# Altium schematic sheet Power.SchDoc
size A; SheetNumber: 3; SheetTotal: 3
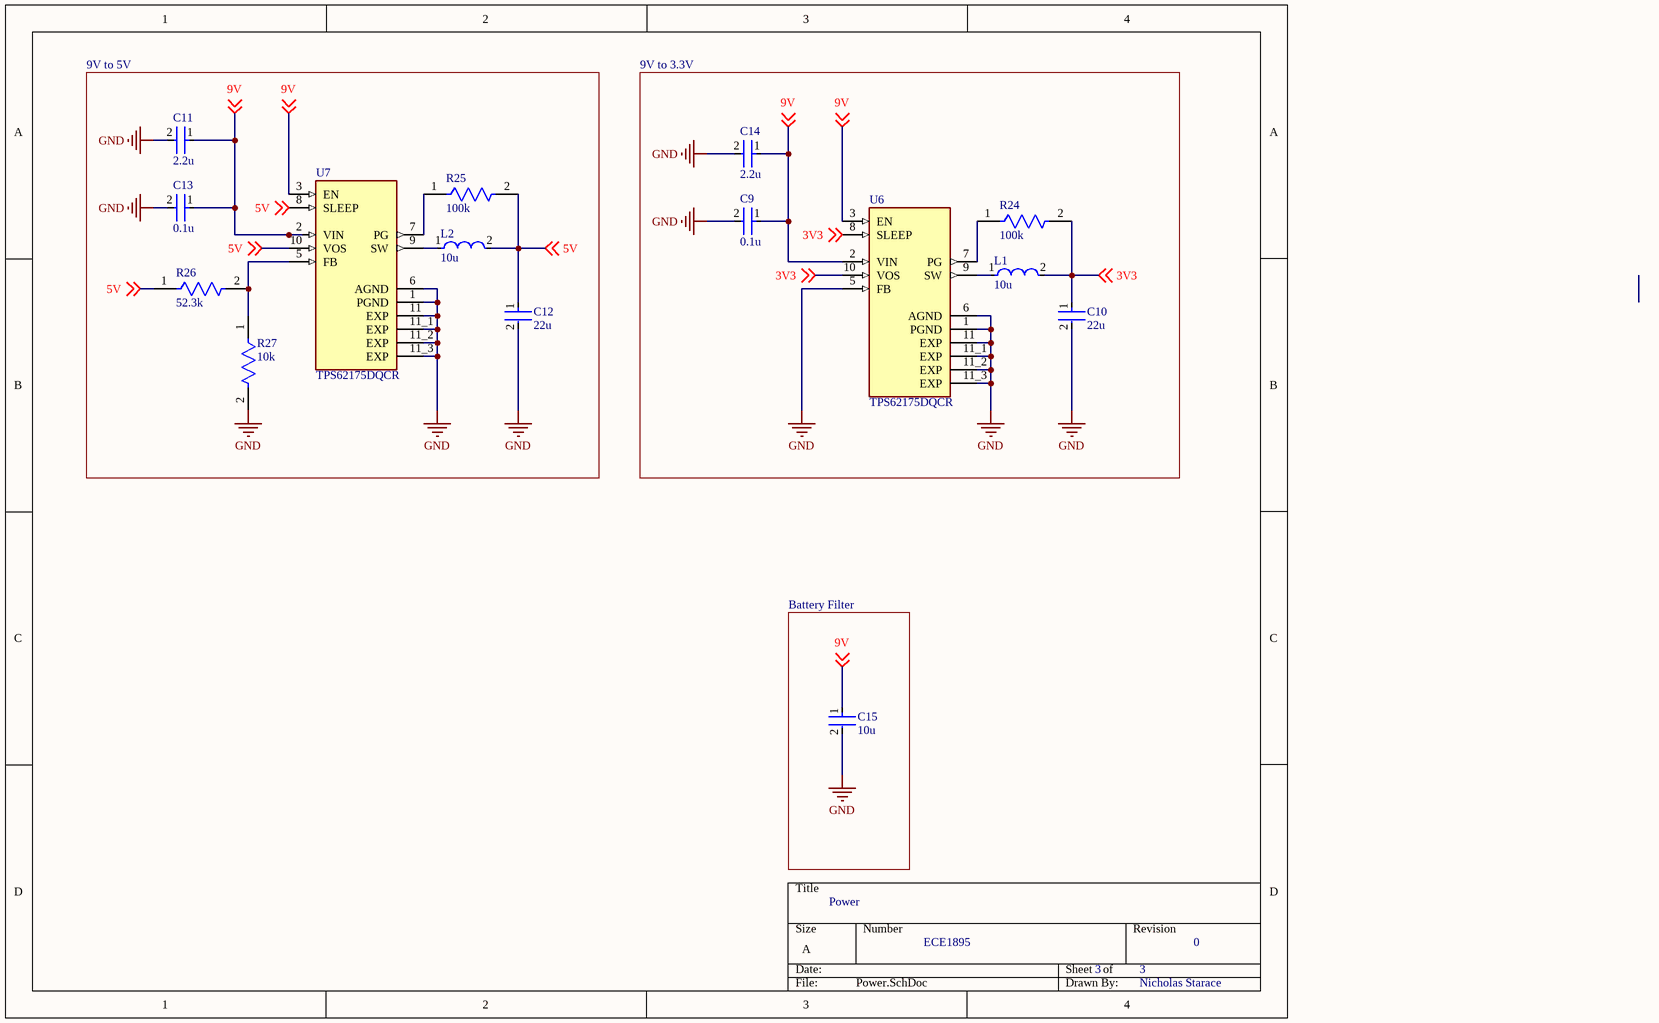
[diagram p0: Power.SchDoc]

## Parts
C9  0.1u  [FP-GRM21B-0_2-e0_2_0_7-IPC_B]
C10  22u  [FP-GRM21B-0_2-e0_2_0_7-IPC_B]
C11  2.2u  [FP-GRM21B-0_2-e0_2_0_7-IPC_B]
C12  22u  [FP-GRM21B-0_2-e0_2_0_7-IPC_B]
C13  0.1u  [FP-GRM21B-0_2-e0_2_0_7-IPC_B]
C14  2.2u  [FP-GRM21B-0_2-e0_2_0_7-IPC_B]
C15  10u  [FP-GRM21B-0_2-e0_2_0_7-IPC_B]
L1  10u  [FP-LQM21DN_70-MFG]
L2  10u  [FP-LQM21DN_70-MFG]
R24  100k  [FP-TFCR0805-MFG]
R25  100k  [FP-TFCR0805-MFG]
R26  52.3k  [FP-TFCR0805-MFG]
R27  10k  [FP-TFCR0805-MFG]
U6  TPS62175DQCR  [SON50P300X200X80-11N240X84]
U7  TPS62175DQCR  [SON50P300X200X80-11N240X84]

## Blocks framed on the sheet
9V to 5V: C11-C13 L2 R25-R27 U7
9V to 3.3V: C9 C10 C14 L1 R24 U6
Battery Filter: C15

## Nets
GND: C9.2 C10.2 C11.2 C12.2 C13.2 C14.2 C15.2 R27.2 U6.1(PGND) U6.5(FB) U6.6(AGND) U6.11(EXP) U6.11_1(EXP) U6.11_2(EXP) U6.11_3(EXP) U7.1(PGND) U7.6(AGND) U7.11(EXP) U7.11_1(EXP) U7.11_2(EXP) U7.11_3(EXP)
3V3: C10.1 L1.2 R24.2 U6.8(SLEEP) U6.10(VOS) ; off-sheet 3V3
5V: C12.1 L2.2 R25.2 R26.1 U7.8(SLEEP) U7.10(VOS) ; off-sheet 5V
9V: C9.1 C11.1 C13.1 C14.1 C15.1 U6.2(VIN) U6.3(EN) U7.2(VIN) U7.3(EN) ; off-sheet 9V
NetL1_1: L1.1 U6.9(SW)
NetL2_1: L2.1 U7.9(SW)
NetR24_1: R24.1 U6.7(PG)
NetR25_1: R25.1 U7.7(PG)
NetR26_2: R26.2 R27.1 U7.5(FB)

## Notes on the sheet
- Power
- ECE1895
- 3
- 0
- Nicholas Starace

## Library data of the parts
C9-C15 = CMP-06035-063309-1: CAP CER 2.2UF 100V X7T 0805
L1 L2 = CMP-00260-111578617-1: LQM21DN330M70L Multilayer Inductor, 33 µH, 2.99 ohm, 16 MHz, 200 mA, 0805 [2012 Metric], LQM; Manufacturer Lifecycle Status: IN PRODUCTION NEW; Saturation Current: 80mA; Tolerance: 20%; Resistance: 2.99Ω; Inductance: 33µH; Self Resonant Frequency: 16MHz; RMS Current (Irms): 200mA; Core Material: Ferrite; Test Frequency: 1MHz; NexarPartId: 111578617; Height: 1.45mm; Case/Package: 0805; Schedule B: 8504500000, 8504500000; Current Rating: 200mA; Max Operating Temperature: 125°C; Series Resistance: 2.99Ω; Min Operating Temperature: -55°C
R24-R27 = CMP-250906-142014-1: RES Thin Film,  1.72kΩ, 1%, 0.125W, 25ppm/°C, 0805
U6 U7 = TPS62175DQCR: 28V, 0.5A Step-Down Converter with SNOOZE Mode 10-WSON -40 to 85; MF: Texas Instruments; MP: TPS62175DQCR; Price: None; Purchase-URL: https://pricing.snapeda.com/search/part/TPS62175DQCR/?ref=eda; Package: WSON-10 Texas Instruments; Check_prices: https://www.snapeda.com/parts/TPS62175DQCR/Texas%20Instruments/view-part/494000/?ref=eda; Value: *; Availability: Good; SnapEDA_Link: https://www.snapeda.com/parts/TPS62175DQCR/Texas%20Instruments/view-part/494000/?ref=snap